# Altium project SnippetsRadio.PrjPCB
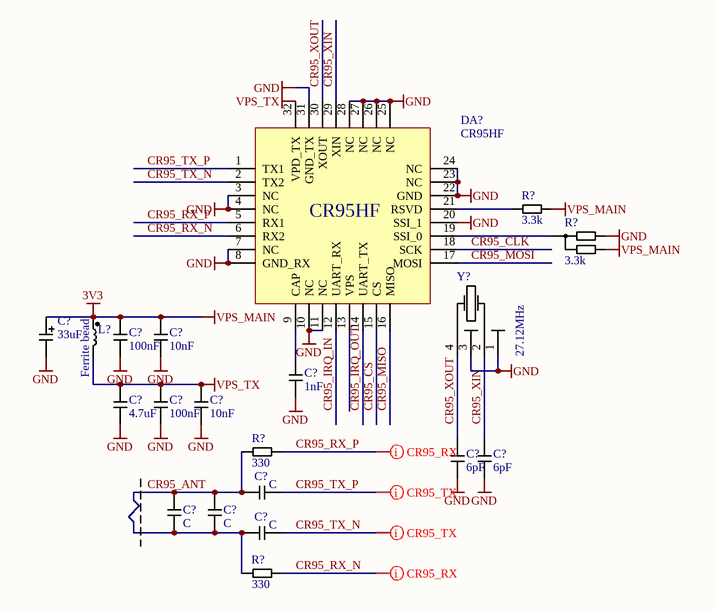
[diagram p0: CR95HF_nfc_simple.SchDoc]
7 sheets, 123 parts. Net scope: global (net labels, ports and power ports of the same name join across sheets).
Sheets:
  CR95HF_nfc_simple.SchDoc
  MFRC522_nfc_simple.SchDoc
  CC8520_simple.SchDoc
  CC110L_868-915MHz.SchDoc
  CC110L_868-915MHz_balun.SchDoc
  CC110L_868-915MHz_balun_external_ant.SchDoc
  CC110L_868-915MHz_external_ant.SchDoc

## Sheet CR95HF_nfc_simple.SchDoc
size A4

### Parts
(Parts that share a designator on the sheet are numbered #1, #2 ... from top to bottom, then left to right.)
C?#1  33uF  [SMD A]
C?#2  100nF  [C0603]
C?#3  10nF  [C0603]
C?#4  1nF  [C0603]
C?#5  4.7uF  [C0603]
C?#6  100nF  [C0603]
C?#7  10nF  [C0603]
C?#8  6pF  [C0603]
C?#9  6pF  [C0603]
C?#10  C  [C0603]
C?#11  C  [C0603]
C?#12  C  [C0603]
C?#13  C  [C0603]
DA?#1  CR95HF  [VFQFPN-32]
L?#1  Ferrite bead  [L0805]
R?#1  3.3k  [R0603]
R?#2  3.3k  [R0603_CHOISE]
R?#3  330  [R0603]
R?#4  330  [R0603]
Y?#1  27.12MHz  [Xtal 0532]

### Nets
3V3: C?#1.1 C?#2.1 C?#3.1 L?#1.1 R?#1.2 R?#2.3  [also labelled VPS_MAIN]
GND: C?#1.2 C?#2.2 C?#3.2 C?#4.2 C?#5.2 C?#6.2 C?#7.2 C?#8.2 C?#9.2 DA?#1.3(NC) DA?#1.4(NC) DA?#1.7(NC) DA?#1.8(GND_RX) DA?#1.10(NC) DA?#1.11(NC) DA?#1.20(SSI_1) DA?#1.22(GND) DA?#1.23(NC) DA?#1.24(NC) DA?#1.25(NC) DA?#1.26(NC) DA?#1.27(NC) DA?#1.28(NC) DA?#1.31(GND_TX) R?#2.1 Y?#1.1(X1) Y?#1.3(X2)
VPS_TX: C?#5.1 C?#6.1 C?#7.1 DA?#1.32(VPD_TX) L?#1.2
CR95_ANT: C?#10.1 C?#11.1 C?#11.2 C?#12.1 C?#12.2 C?#13.1 R?#3.1 R?#4.1
CR95_CLK: DA?#1.18(SCK)
CR95_CS: DA?#1.15(CS)
CR95_IRQ_IN: DA?#1.12(UART_RX)
CR95_IRQ_OUT: DA?#1.14(UART_TX)
CR95_MISO: DA?#1.16(MISO)
CR95_MOSI: DA?#1.17(MOSI)
CR95_RX_N: DA?#1.6(RX2) R?#4.2
CR95_RX_P: DA?#1.5(RX1) R?#3.2
CR95_TX_N: C?#13.2 DA?#1.2(TX2)
CR95_TX_P: C?#10.2 DA?#1.1(TX1)
CR95_XIN: C?#9.1 DA?#1.29(XIN) Y?#1.2(GND)
CR95_XOUT: C?#8.1 DA?#1.30(XOUT) Y?#1.4(GND)
NetC?#4_1: C?#4.1 DA?#1.9(CAP)
NetDA?#1_19: DA?#1.19(SSI_0) R?#2.2
NetDA?#1_21: DA?#1.21(RSVD) R?#1.1

Not connected (* = marked no-connect by the designer): DA?#1 13(VPS)

### Layout directives
differential pair: CR95_RX_N, CR95_RX_P, CR95_TX_N, CR95_TX_P

### Library data of the parts
C?#1 = CP: Capacitor polarized
C?#2-C?#13 = C: Capacitor
DA?#1 = CR95HF: RFID IC with SPI/UART
L?#1 = L: Inductor
R?#1 R?#3 R?#4 = R: Resistor
R?#2 = R_Choise: R for choise
Y?#1 = Xtal: Quartz crystal

## Sheet MFRC522_nfc_simple.SchDoc
size A4
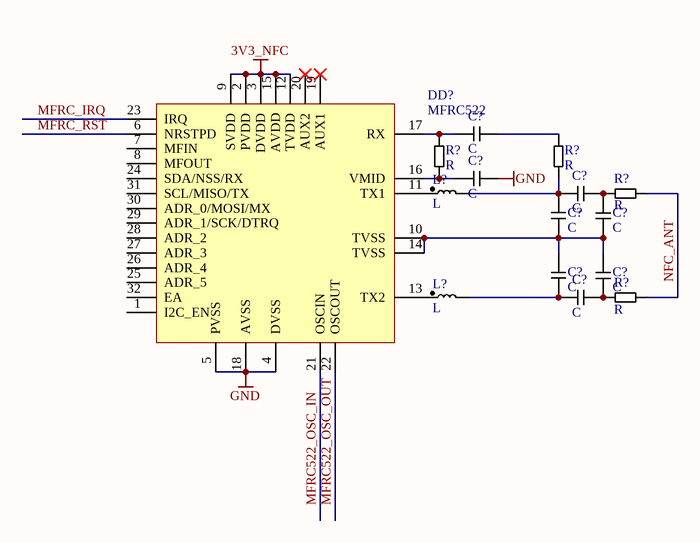
[diagram p1: MFRC522_nfc_simple.SchDoc]

### Parts
(Parts that share a designator on the sheet are numbered #1, #2 ... from top to bottom, then left to right.)
C?#14  C  [C0603]
C?#15  C  [C0603]
C?#16  C  [C0603]
C?#17  C  [C0603]
C?#18  C  [C0603]
C?#19  C  [C0603]
C?#20  C  [C0603]
C?#21  C  [C0603]
DD?#1  MFRC522  [VFQFPN-32]
L?#2  L  [L0603]
L?#3  L  [L0603]
R?#5  R  [R0603]
R?#6  R  [R0603]
R?#7  R  [R0603]
R?#8  R  [R0603]

### Nets
3V3_NFC: DD?#1.2(PVDD) DD?#1.3(DVDD) DD?#1.9(SVDD) DD?#1.12(TVDD) DD?#1.15(AVDD)
GND: C?#15.2 DD?#1.4(DVSS) DD?#1.5(PVSS) DD?#1.18(AVSS)
MFRC522_OSC_IN: DD?#1.21(OSCIN)
MFRC522_OSC_OUT: DD?#1.22(OSCOUT)
MFRC_IRQ: DD?#1.23(IRQ)
MFRC_RST: DD?#1.6(NRSTPD)
NFC_ANT: R?#7.2 R?#8.2
NetC?#14_1: C?#14.1 DD?#1.17(RX) R?#5.2
NetC?#14_2: C?#14.2 R?#6.2
NetC?#15_1: C?#15.1 DD?#1.16(VMID) R?#5.1
NetC?#16_1: C?#16.1 C?#17.1 L?#2.2 R?#6.1
NetC?#16_2: C?#16.2 C?#18.2 R?#7.1
NetC?#17_2: C?#17.2 C?#18.1 C?#19.1 C?#20.2 DD?#1.10(TVSS) DD?#1.14(TVSS)
NetC?#19_2: C?#19.2 C?#21.1 L?#3.2
NetC?#20_1: C?#20.1 C?#21.2 R?#8.1
NetDD?#1_11: DD?#1.11(TX1) L?#2.1
NetDD?#1_13: DD?#1.13(TX2) L?#3.1

Not connected (* = marked no-connect by the designer): DD?#1 1(I2C_EN) 7(MFIN) 8(MFOUT) 19(AUX1)* 20(AUX2)* 24(SDA/NSS/RX) 25(ADR_5) 26(ADR_4) 27(ADR_3) 28(ADR_2) 29(ADR_1/SCK/DTRQ) 30(ADR_0/MOSI/MX) 31(SCL/MISO/TX) 32(EA)

### Library data of the parts
C?#14-C?#21 = C: Capacitor
DD?#1 = MFRC522: NXP Mifare NFC reader
L?#2 L?#3 = L: Inductor
R?#5-R?#8 = R: Resistor

## Sheet CC8520_simple.SchDoc
size A4
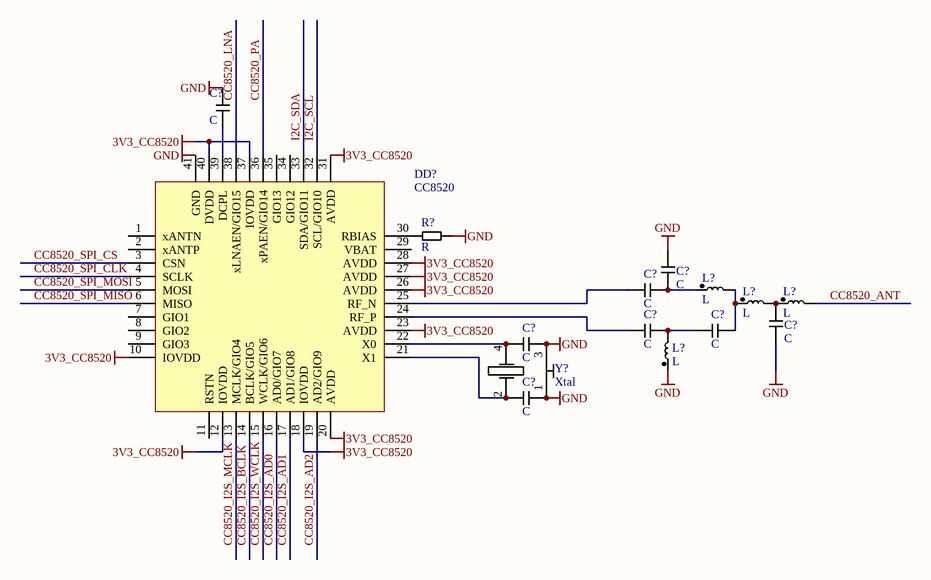
[diagram p2: CC8520_simple.SchDoc]

### Parts
(Parts that share a designator on the sheet are numbered #1, #2 ... from top to bottom, then left to right.)
C?#22  C  [C0402]
C?#23  C  [C0402]
C?#24  C  [C0402]
C?#25  C  [C0402]
C?#26  C  [C0402]
C?#27  C  [C0402]
C?#28  C  [C0402]
C?#29  C  [C0402]
DD?#2  CC8520  [QFN-40]
L?#4  L  [L0402]
L?#5  L  [L0402]
L?#6  L  [L0402]
L?#7  L  [L0402]
R?#9  R  [R0402]
Y?#2  Xtal  [XTAL 2016]

### Nets
3V3_CC8520: DD?#2.10(IOVDD) DD?#2.12(IOVDD) DD?#2.18(IOVDD) DD?#2.20(AVDD) DD?#2.23(AVDD) DD?#2.26(AVDD) DD?#2.27(AVDD) DD?#2.28(AVDD) DD?#2.31(AVDD) DD?#2.37(IOVDD) DD?#2.40(DVDD)
GND: C?#22.1 C?#23.1 C?#25.2 C?#28.2 C?#29.2 DD?#2.41(GND) L?#7.1 R?#9.2 Y?#2.1(X1) Y?#2.3(X2)
CC8520_ANT: L?#6.2
CC8520_I2S_AD0: DD?#2.16(AD0/GIO7)
CC8520_I2S_AD1: DD?#2.17(AD1/GIO8)
CC8520_I2S_AD2: DD?#2.19(AD2/GIO9)
CC8520_I2S_BCLK: DD?#2.14(BCLK/GIO5)
CC8520_I2S_MCLK: DD?#2.13(MCLK/GIO4)
CC8520_I2S_WCLK: DD?#2.15(WCLK/GIO6)
CC8520_LNA: DD?#2.38(xLNAEN/GIO15)
CC8520_PA: DD?#2.36(xPAEN/GIO14)
CC8520_SPI_CLK: DD?#2.4(SCLK)
CC8520_SPI_CS: DD?#2.3(CSN)
CC8520_SPI_MISO: DD?#2.6(MISO)
CC8520_SPI_MOSI: DD?#2.5(MOSI)
I2C_SCL: DD?#2.32(SCL/GIO10)
I2C_SDA: DD?#2.33(SDA/GIO11)
NetC?#22_2: C?#22.2 DD?#2.39(DCPL)
NetC?#23_2: C?#23.2 C?#24.2 L?#4.1
NetC?#24_1: C?#24.1 DD?#2.25(RF_N)
NetC?#25_1: C?#25.1 L?#5.2 L?#6.1
NetC?#26_1: C?#26.1 DD?#2.24(RF_P)
NetC?#26_2: C?#26.2 C?#27.1 L?#7.2
NetC?#27_2: C?#27.2 L?#4.2 L?#5.1
NetC?#28_1: C?#28.1 DD?#2.22(X0) Y?#2.4(GND)
NetC?#29_1: C?#29.1 DD?#2.21(X1) Y?#2.2(GND)
NetDD?#2_30: DD?#2.30(RBIAS) R?#9.1

Not connected (* = marked no-connect by the designer): DD?#2 1(xANTN) 2(xANTP) 7(GIO1) 8(GIO2) 9(GIO3) 11(RSTN) 29(VBAT) 34(GIO12) 35(GIO13)

### Library data of the parts
C?#22-C?#29 = C: Capacitor
DD?#2 = CC8520: TI Wireless Audio tranciever
L?#4-L?#7 = L: Inductor
R?#9 = R: Resistor
Y?#2 = Xtal: Quartz crystal

## Sheet CC110L_868-915MHz.SchDoc
size A4
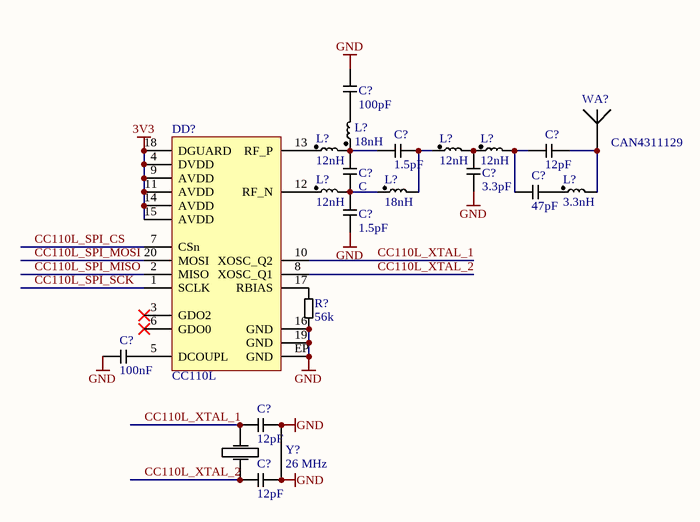
[diagram p3: CC110L_868-915MHz.SchDoc]

### Parts
(Parts that share a designator on the sheet are numbered #1, #2 ... from top to bottom, then left to right.)
C?#30  100pF  [C0603]
C?#31  1.5pF  [C0603]
C?#32  12pF  [C0603]
C?#33  C  [C0603]
C?#34  3.3pF  [C0603]
C?#35  47pF  [C0603]
C?#36  1.5pF  [C0603]
C?#37  100nF  [C0603]
C?#38  12pF  [C0603]
C?#39  12pF  [C0603]
DD?#3  CC110L  [QFN-20]
L?#8  18nH  [L0603]
L?#9  12nH  [L0603]
L?#10  12nH  [L0603]
L?#11  12nH  [L0603]
L?#12  12nH  [L0603]
L?#13  18nH  [L0603]
L?#14  3.3nH  [L0603]
R?#10  56k  [R0603]
WA?#1  CAN4311129  [CAN4311129090871K]
Y?#3  26 MHz  [Xtal 0532]

### Nets
3V3: DD?#3.4(DVDD) DD?#3.9(AVDD) DD?#3.11(AVDD) DD?#3.14(AVDD) DD?#3.15(AVDD) DD?#3.18(DGUARD)
GND: C?#30.1 C?#34.1 C?#36.2 C?#37.1 C?#38.2 C?#39.2 DD?#3.16(GND) DD?#3.19(GND) DD?#3.EP(GND) R?#10.1 Y?#3.1(X1) Y?#3.3(X2)
CC110L_SPI_CS: DD?#3.7(CSn)
CC110L_SPI_MISO: DD?#3.2(MISO)
CC110L_SPI_MOSI: DD?#3.20(MOSI)
CC110L_SPI_SCK: DD?#3.1(SCLK)
CC110L_XTAL_1: C?#38.1 DD?#3.10(XOSC_Q2) Y?#3.4(GND)
CC110L_XTAL_2: C?#39.1 DD?#3.8(XOSC_Q1) Y?#3.2(GND)
NetC?#30_2: C?#30.2 L?#8.2
NetC?#31_1: C?#31.1 C?#33.1 L?#8.1 L?#9.2
NetC?#31_2: C?#31.2 L?#10.1 L?#13.2
NetC?#32_1: C?#32.1 C?#35.1 L?#11.2
NetC?#32_2: C?#32.2 L?#14.2 WA?#1.1(ANT)
NetC?#33_2: C?#33.2 C?#36.1 L?#12.2 L?#13.1
NetC?#34_2: C?#34.2 L?#10.2 L?#11.1
NetC?#35_2: C?#35.2 L?#14.1
NetC?#37_2: C?#37.2 DD?#3.5(DCOUPL)
NetDD?#3_12: DD?#3.12(RF_N) L?#12.1
NetDD?#3_13: DD?#3.13(RF_P) L?#9.1
NetDD?#3_17: DD?#3.17(RBIAS) R?#10.2

Not connected (* = marked no-connect by the designer): DD?#3 3(GDO2)* 6(GDO0)*

### Library data of the parts
C?#30-C?#39 = C: Capacitor
DD?#3 = CC110L: Value Line Transceiver
L?#8-L?#14 = L: Inductor
R?#10 = R: Resistor
WA?#1 = 868 MHz ANT
Y?#3 = Xtal: Quartz crystal

## Sheet CC110L_868-915MHz_balun.SchDoc
size A4
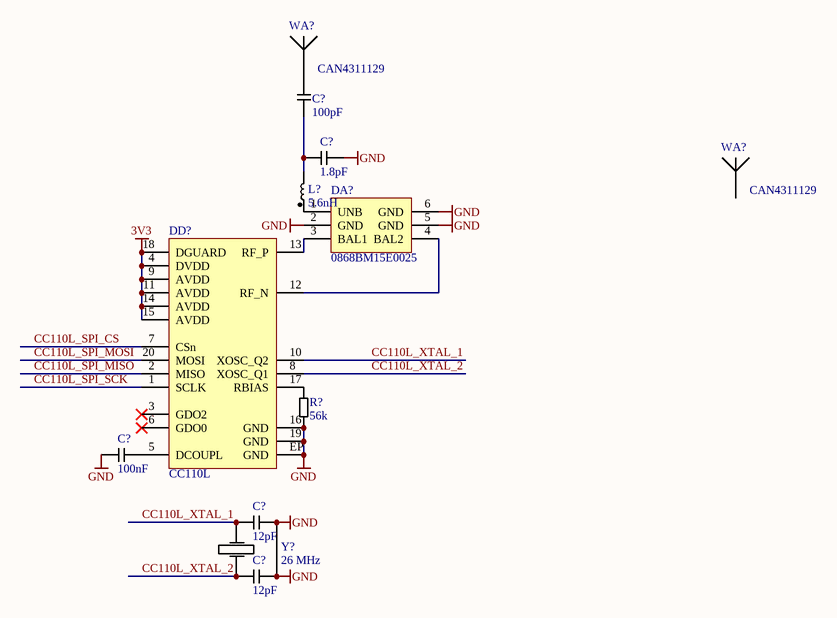
[diagram p4: CC110L_868-915MHz_balun.SchDoc]

### Parts
(Parts that share a designator on the sheet are numbered #1, #2 ... from top to bottom, then left to right.)
C?#40  100pF  [C0603]
C?#41  1.8pF  [C0603]
C?#42  100nF  [C0603]
C?#43  12pF  [C0603]
C?#44  12pF  [C0603]
DA?#2  0868BM15E0025  [xxxxBM15yyyyy]
DD?#4  CC110L  [QFN-20]
L?#15  5.6nH  [L0603]
R?#11  56k  [R0603]
WA?#2  CAN4311129  [CAN4311129090871K]
WA?#3  CAN4311129  [CAN4311129090871K]
Y?#4  26 MHz  [Xtal 0532]

### Nets
3V3: DD?#4.4(DVDD) DD?#4.9(AVDD) DD?#4.11(AVDD) DD?#4.14(AVDD) DD?#4.15(AVDD) DD?#4.18(DGUARD)
GND: C?#41.2 C?#42.1 C?#43.2 C?#44.2 DA?#2.2(GND) DA?#2.5(GND) DA?#2.6(GND) DD?#4.16(GND) DD?#4.19(GND) DD?#4.EP(GND) R?#11.1 Y?#4.1(X1) Y?#4.3(X2)
CC110L_SPI_CS: DD?#4.7(CSn)
CC110L_SPI_MISO: DD?#4.2(MISO)
CC110L_SPI_MOSI: DD?#4.20(MOSI)
CC110L_SPI_SCK: DD?#4.1(SCLK)
CC110L_XTAL_1: C?#43.1 DD?#4.10(XOSC_Q2) Y?#4.4(GND)
CC110L_XTAL_2: C?#44.1 DD?#4.8(XOSC_Q1) Y?#4.2(GND)
NetC?#40_1: C?#40.1 C?#41.1 L?#15.2
NetC?#40_2: C?#40.2 WA?#2.1(ANT)
NetC?#42_2: C?#42.2 DD?#4.5(DCOUPL)
NetDA?#2_1: DA?#2.1(UNB) L?#15.1
NetDA?#2_3: DA?#2.3(BAL1) DD?#4.13(RF_P)
NetDA?#2_4: DA?#2.4(BAL2) DD?#4.12(RF_N)
NetDD?#4_17: DD?#4.17(RBIAS) R?#11.2

Not connected (* = marked no-connect by the designer): DD?#4 3(GDO2)* 6(GDO0)*; WA?#3 1(ANT)

### Library data of the parts
C?#40-C?#44 = C: Capacitor
DA?#2 = xxxxBM15E0025: Balun for CC11xx Johanson Technology; DigiKey: http://www.digikey.com/short/3pj8pb
DD?#4 = CC110L: Value Line Transceiver
L?#15 = L: Inductor
R?#11 = R: Resistor
WA?#2 WA?#3 = 868 MHz ANT
Y?#4 = Xtal: Quartz crystal

## Sheet CC110L_868-915MHz_balun_external_ant.SchDoc
size A4
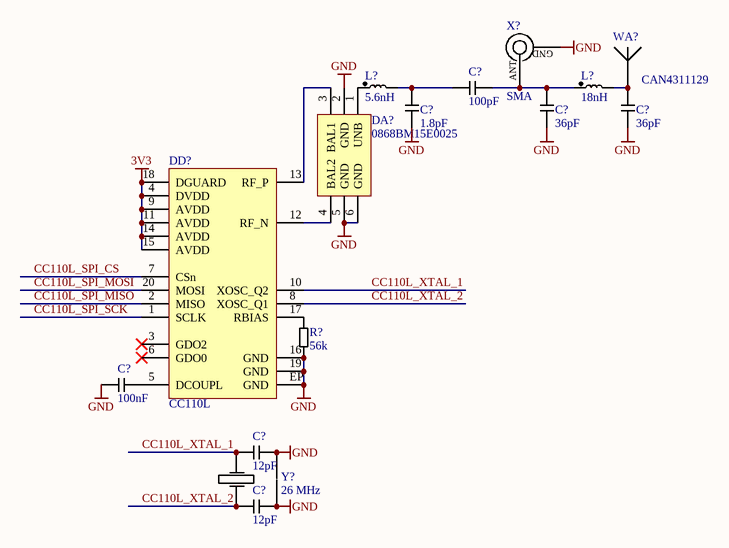
[diagram p5: CC110L_868-915MHz_balun_external_ant.SchDoc]

### Parts
(Parts that share a designator on the sheet are numbered #1, #2 ... from top to bottom, then left to right.)
C?#45  100pF  [C0603]
C?#46  1.8pF  [C0603]
C?#47  36pF  [C0603]
C?#48  36pF  [C0603]
C?#49  100nF  [C0603]
C?#50  12pF  [C0603]
C?#51  12pF  [C0603]
DA?#3  0868BM15E0025  [xxxxBM15yyyyy]
DD?#5  CC110L  [QFN-20]
L?#16  5.6nH  [L0603]
L?#17  18nH  [L0603]
R?#12  56k  [R0603]
WA?#4  CAN4311129  [CAN4311129090871K]
X?#1  SMA  [SMA]
Y?#5  26 MHz  [Xtal 0532]

### Nets
3V3: DD?#5.4(DVDD) DD?#5.9(AVDD) DD?#5.11(AVDD) DD?#5.14(AVDD) DD?#5.15(AVDD) DD?#5.18(DGUARD)
GND: C?#46.2 C?#47.2 C?#48.2 C?#49.1 C?#50.2 C?#51.2 DA?#3.2(GND) DA?#3.5(GND) DA?#3.6(GND) DD?#5.16(GND) DD?#5.19(GND) DD?#5.EP(GND) R?#12.1 X?#1.1 Y?#5.1(X1) Y?#5.3(X2)
CC110L_SPI_CS: DD?#5.7(CSn)
CC110L_SPI_MISO: DD?#5.2(MISO)
CC110L_SPI_MOSI: DD?#5.20(MOSI)
CC110L_SPI_SCK: DD?#5.1(SCLK)
CC110L_XTAL_1: C?#50.1 DD?#5.10(XOSC_Q2) Y?#5.4(GND)
CC110L_XTAL_2: C?#51.1 DD?#5.8(XOSC_Q1) Y?#5.2(GND)
NetC?#45_1: C?#45.1 C?#46.1 L?#16.2
NetC?#45_2: C?#45.2 C?#47.1 L?#17.1 X?#1.2
NetC?#48_1: C?#48.1 L?#17.2 WA?#4.1(ANT)
NetC?#49_2: C?#49.2 DD?#5.5(DCOUPL)
NetDA?#3_1: DA?#3.1(UNB) L?#16.1
NetDA?#3_3: DA?#3.3(BAL1) DD?#5.13(RF_P)
NetDA?#3_4: DA?#3.4(BAL2) DD?#5.12(RF_N)
NetDD?#5_17: DD?#5.17(RBIAS) R?#12.2

Not connected (* = marked no-connect by the designer): DD?#5 3(GDO2)* 6(GDO0)*

### Notes on the sheet
- (in symbol SMA) GND; ANT

### Library data of the parts
C?#45-C?#51 = C: Capacitor
DA?#3 = xxxxBM15E0025: Balun for CC11xx Johanson Technology; DigiKey: http://www.digikey.com/short/3pj8pb
DD?#5 = CC110L: Value Line Transceiver
L?#16 L?#17 = L: Inductor
R?#12 = R: Resistor
WA?#4 = 868 MHz ANT
X?#1 = SMA: SMA slot
Y?#5 = Xtal: Quartz crystal

## Sheet CC110L_868-915MHz_external_ant.SchDoc
size A4
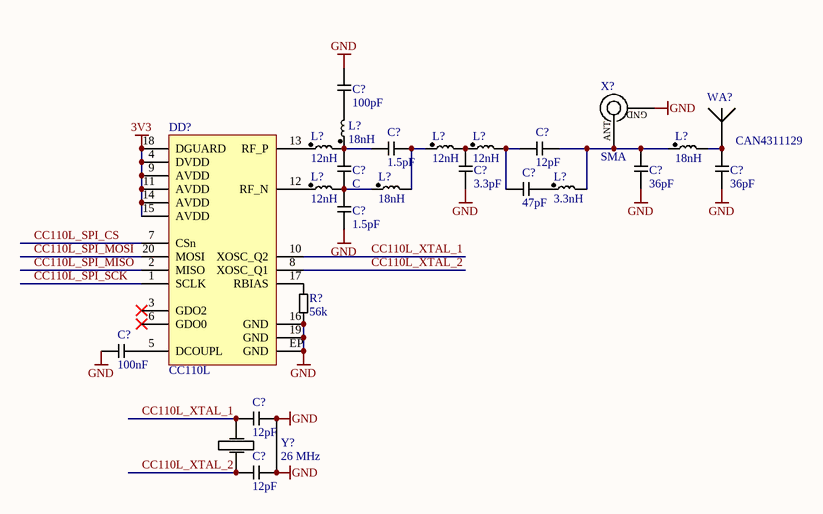
[diagram p6: CC110L_868-915MHz_external_ant.SchDoc]

### Parts
(Parts that share a designator on the sheet are numbered #1, #2 ... from top to bottom, then left to right.)
C?#52  100pF  [C0603]
C?#53  1.5pF  [C0603]
C?#54  12pF  [C0603]
C?#55  C  [C0603]
C?#56  36pF  [C0603]
C?#57  36pF  [C0603]
C?#58  3.3pF  [C0603]
C?#59  47pF  [C0603]
C?#60  1.5pF  [C0603]
C?#61  100nF  [C0603]
C?#62  12pF  [C0603]
C?#63  12pF  [C0603]
DD?#6  CC110L  [QFN-20]
L?#18  18nH  [L0603]
L?#19  12nH  [L0603]
L?#20  12nH  [L0603]
L?#21  12nH  [L0603]
L?#22  18nH  [L0603]
L?#23  12nH  [L0603]
L?#24  18nH  [L0603]
L?#25  3.3nH  [L0603]
R?#13  56k  [R0603]
WA?#5  CAN4311129  [CAN4311129090871K]
X?#2  SMA  [SMA]
Y?#6  26 MHz  [Xtal 0532]

### Nets
3V3: DD?#6.4(DVDD) DD?#6.9(AVDD) DD?#6.11(AVDD) DD?#6.14(AVDD) DD?#6.15(AVDD) DD?#6.18(DGUARD)
GND: C?#52.1 C?#56.2 C?#57.2 C?#58.1 C?#60.2 C?#61.1 C?#62.2 C?#63.2 DD?#6.16(GND) DD?#6.19(GND) DD?#6.EP(GND) R?#13.1 X?#2.1 Y?#6.1(X1) Y?#6.3(X2)
CC110L_SPI_CS: DD?#6.7(CSn)
CC110L_SPI_MISO: DD?#6.2(MISO)
CC110L_SPI_MOSI: DD?#6.20(MOSI)
CC110L_SPI_SCK: DD?#6.1(SCLK)
CC110L_XTAL_1: C?#62.1 DD?#6.10(XOSC_Q2) Y?#6.4(GND)
CC110L_XTAL_2: C?#63.1 DD?#6.8(XOSC_Q1) Y?#6.2(GND)
NetC?#52_2: C?#52.2 L?#18.2
NetC?#53_1: C?#53.1 C?#55.1 L?#18.1 L?#19.2
NetC?#53_2: C?#53.2 L?#20.1 L?#24.2
NetC?#54_1: C?#54.1 C?#59.1 L?#21.2
NetC?#54_2: C?#54.2 C?#56.1 L?#22.1 L?#25.2 X?#2.2
NetC?#55_2: C?#55.2 C?#60.1 L?#23.2 L?#24.1
NetC?#57_1: C?#57.1 L?#22.2 WA?#5.1(ANT)
NetC?#58_2: C?#58.2 L?#20.2 L?#21.1
NetC?#59_2: C?#59.2 L?#25.1
NetC?#61_2: C?#61.2 DD?#6.5(DCOUPL)
NetDD?#6_12: DD?#6.12(RF_N) L?#23.1
NetDD?#6_13: DD?#6.13(RF_P) L?#19.1
NetDD?#6_17: DD?#6.17(RBIAS) R?#13.2

Not connected (* = marked no-connect by the designer): DD?#6 3(GDO2)* 6(GDO0)*

### Notes on the sheet
- (in symbol SMA) GND; ANT

### Library data of the parts
C?#52-C?#63 = C: Capacitor
DD?#6 = CC110L: Value Line Transceiver
L?#18-L?#25 = L: Inductor
R?#13 = R: Resistor
WA?#5 = 868 MHz ANT
X?#2 = SMA: SMA slot
Y?#6 = Xtal: Quartz crystal

## Nets that join several sheets
3V3: CR95HF_nfc_simple (6 pins), CC110L_868-915MHz (6 pins), CC110L_868-915MHz_balun (6 pins), CC110L_868-915MHz_balun_external_ant (6 pins), CC110L_868-915MHz_external_ant (6 pins)
GND: CR95HF_nfc_simple (27 pins), MFRC522_nfc_simple (C?#15.2 DD?#1.4 DD?#1.5 DD?#1.18), CC8520_simple (10 pins), CC110L_868-915MHz (12 pins), CC110L_868-915MHz_balun (13 pins), CC110L_868-915MHz_balun_external_ant (16 pins), CC110L_868-915MHz_external_ant (15 pins)
CC110L_SPI_CS: CC110L_868-915MHz (DD?#3.7), CC110L_868-915MHz_balun (DD?#4.7), CC110L_868-915MHz_balun_external_ant (DD?#5.7), CC110L_868-915MHz_external_ant (DD?#6.7)
CC110L_SPI_MISO: CC110L_868-915MHz (DD?#3.2), CC110L_868-915MHz_balun (DD?#4.2), CC110L_868-915MHz_balun_external_ant (DD?#5.2), CC110L_868-915MHz_external_ant (DD?#6.2)
CC110L_SPI_MOSI: CC110L_868-915MHz (DD?#3.20), CC110L_868-915MHz_balun (DD?#4.20), CC110L_868-915MHz_balun_external_ant (DD?#5.20), CC110L_868-915MHz_external_ant (DD?#6.20)
CC110L_SPI_SCK: CC110L_868-915MHz (DD?#3.1), CC110L_868-915MHz_balun (DD?#4.1), CC110L_868-915MHz_balun_external_ant (DD?#5.1), CC110L_868-915MHz_external_ant (DD?#6.1)
CC110L_XTAL_1: CC110L_868-915MHz (C?#38.1 DD?#3.10 Y?#3.4), CC110L_868-915MHz_balun (C?#43.1 DD?#4.10 Y?#4.4), CC110L_868-915MHz_balun_external_ant (C?#50.1 DD?#5.10 Y?#5.4), CC110L_868-915MHz_external_ant (C?#62.1 DD?#6.10 Y?#6.4)
CC110L_XTAL_2: CC110L_868-915MHz (C?#39.1 DD?#3.8 Y?#3.2), CC110L_868-915MHz_balun (C?#44.1 DD?#4.8 Y?#4.2), CC110L_868-915MHz_balun_external_ant (C?#51.1 DD?#5.8 Y?#5.2), CC110L_868-915MHz_external_ant (C?#63.1 DD?#6.8 Y?#6.2)